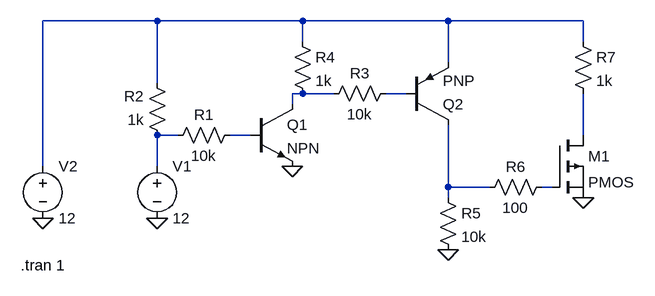
[diagram p0: schematic charger_shtdown.asc]
charger_shtdown.asc, the LTspice schematic file:
Version 4
SHEET 1 880 680
WIRE -32 16 -208 16
WIRE 192 16 -32 16
WIRE 416 16 192 16
WIRE 624 16 416 16
WIRE 192 48 192 16
WIRE 624 48 624 16
WIRE 416 80 416 16
WIRE -32 112 -32 16
WIRE 192 128 176 128
WIRE 240 128 192 128
WIRE 352 128 320 128
WIRE 176 144 176 128
WIRE 0 192 -32 192
WIRE 112 192 80 192
WIRE 624 192 624 128
WIRE -208 240 -208 16
WIRE -32 240 -32 192
WIRE 416 272 416 176
WIRE 480 272 416 272
WIRE 576 272 560 272
WIRE 416 288 416 272
FLAG 176 240 0
FLAG 416 368 0
FLAG -32 320 0
FLAG -208 320 0
FLAG 624 288 0
SYMBOL npn 112 144 R0
SYMATTR InstName Q1
SYMBOL res 96 176 R90
WINDOW 0 0 56 VBottom 2
WINDOW 3 32 56 VTop 2
SYMATTR InstName R1
SYMATTR Value 10k
SYMBOL res -16 208 R180
WINDOW 0 36 76 Left 2
WINDOW 3 36 40 Left 2
SYMATTR InstName R2
SYMATTR Value 1k
SYMBOL res 224 144 R270
WINDOW 0 32 56 VTop 2
WINDOW 3 0 56 VBottom 2
SYMATTR InstName R3
SYMATTR Value 10k
SYMBOL res 176 32 R0
SYMATTR InstName R4
SYMATTR Value 1k
SYMBOL pnp 352 176 M180
SYMATTR InstName Q2
SYMBOL res 400 272 R0
SYMATTR InstName R5
SYMATTR Value 10k
SYMBOL res 576 256 R90
WINDOW 0 0 56 VBottom 2
WINDOW 3 32 56 VTop 2
SYMATTR InstName R6
SYMATTR Value 100
SYMBOL voltage -32 224 R0
WINDOW 123 0 0 Left 0
WINDOW 39 0 0 Left 0
SYMATTR InstName V1
SYMATTR Value 12
SYMBOL voltage -208 224 R0
WINDOW 123 0 0 Left 0
WINDOW 39 0 0 Left 0
SYMATTR InstName V2
SYMATTR Value 12
SYMBOL pmos 576 192 R0
SYMATTR InstName M1
SYMBOL res 608 32 R0
SYMATTR InstName R7
SYMATTR Value 1k
TEXT -242 392 Left 2 !.tran 1

The netlist it stands for:
* charger_shtdown.asc
Q1 N002 N005 0 0 NPN
R1 N005 N004 10k
R2 N004 N001 1k
R3 N002 N003 10k
R4 N001 N002 1k
Q2 N007 N003 N001 0 PNP
R5 N007 0 10k
R6 N008 N007 100
V1 N004 0 12
V2 N001 0 12
M1 N006 N008 0 0 PMOS
R7 N001 N006 1k
.model NPN NPN
.model PNP PNP
.lib standard.bjt
.model NMOS NMOS
.model PMOS PMOS
.lib standard.mos
.tran 1
.backanno
.end